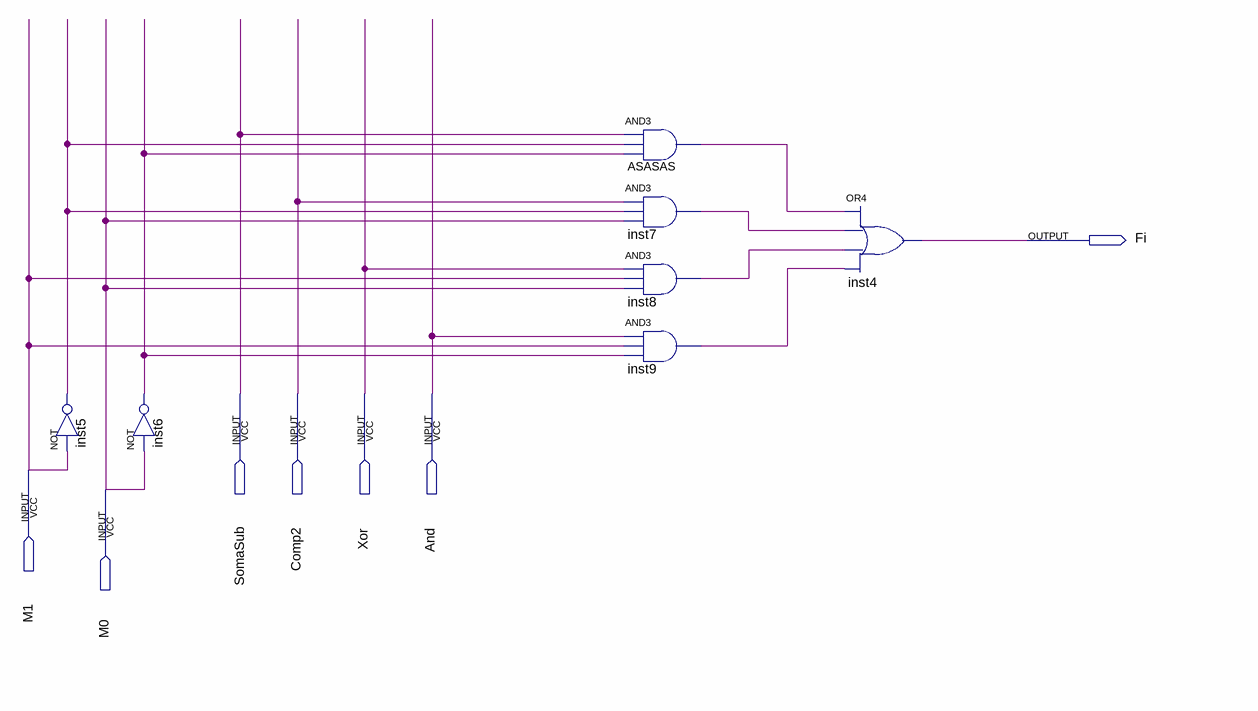
[diagram p0: schematic sheet]
// Quartus schematic MUXcima.bdf as structural Verilog: 7 symbols, 7 pins
module MUXcima (
  input  SomaSub,
  input  Comp2,
  input  Xor,
  input  And,
  input  M1,
  input  M0,
  output Fi
);

  wire ASASAS_out, inst5_out, inst6_out, inst7_out, inst8_out, inst9_out;

  not inst5 (inst5_out, M1);
  not inst6 (inst6_out, M0);
  and ASASAS (ASASAS_out, SomaSub, inst5_out, inst6_out);
  and inst7 (inst7_out, Comp2, inst5_out, M0);
  and inst8 (inst8_out, Xor, M1, M0);
  and inst9 (inst9_out, And, M1, inst6_out);
  or inst4 (Fi, ASASAS_out, inst7_out, inst8_out, inst9_out);
endmodule
